# Altium schematic sheet CONNECTOR.SchDoc
size A3; SheetNumber: 5; SheetTotal: 22
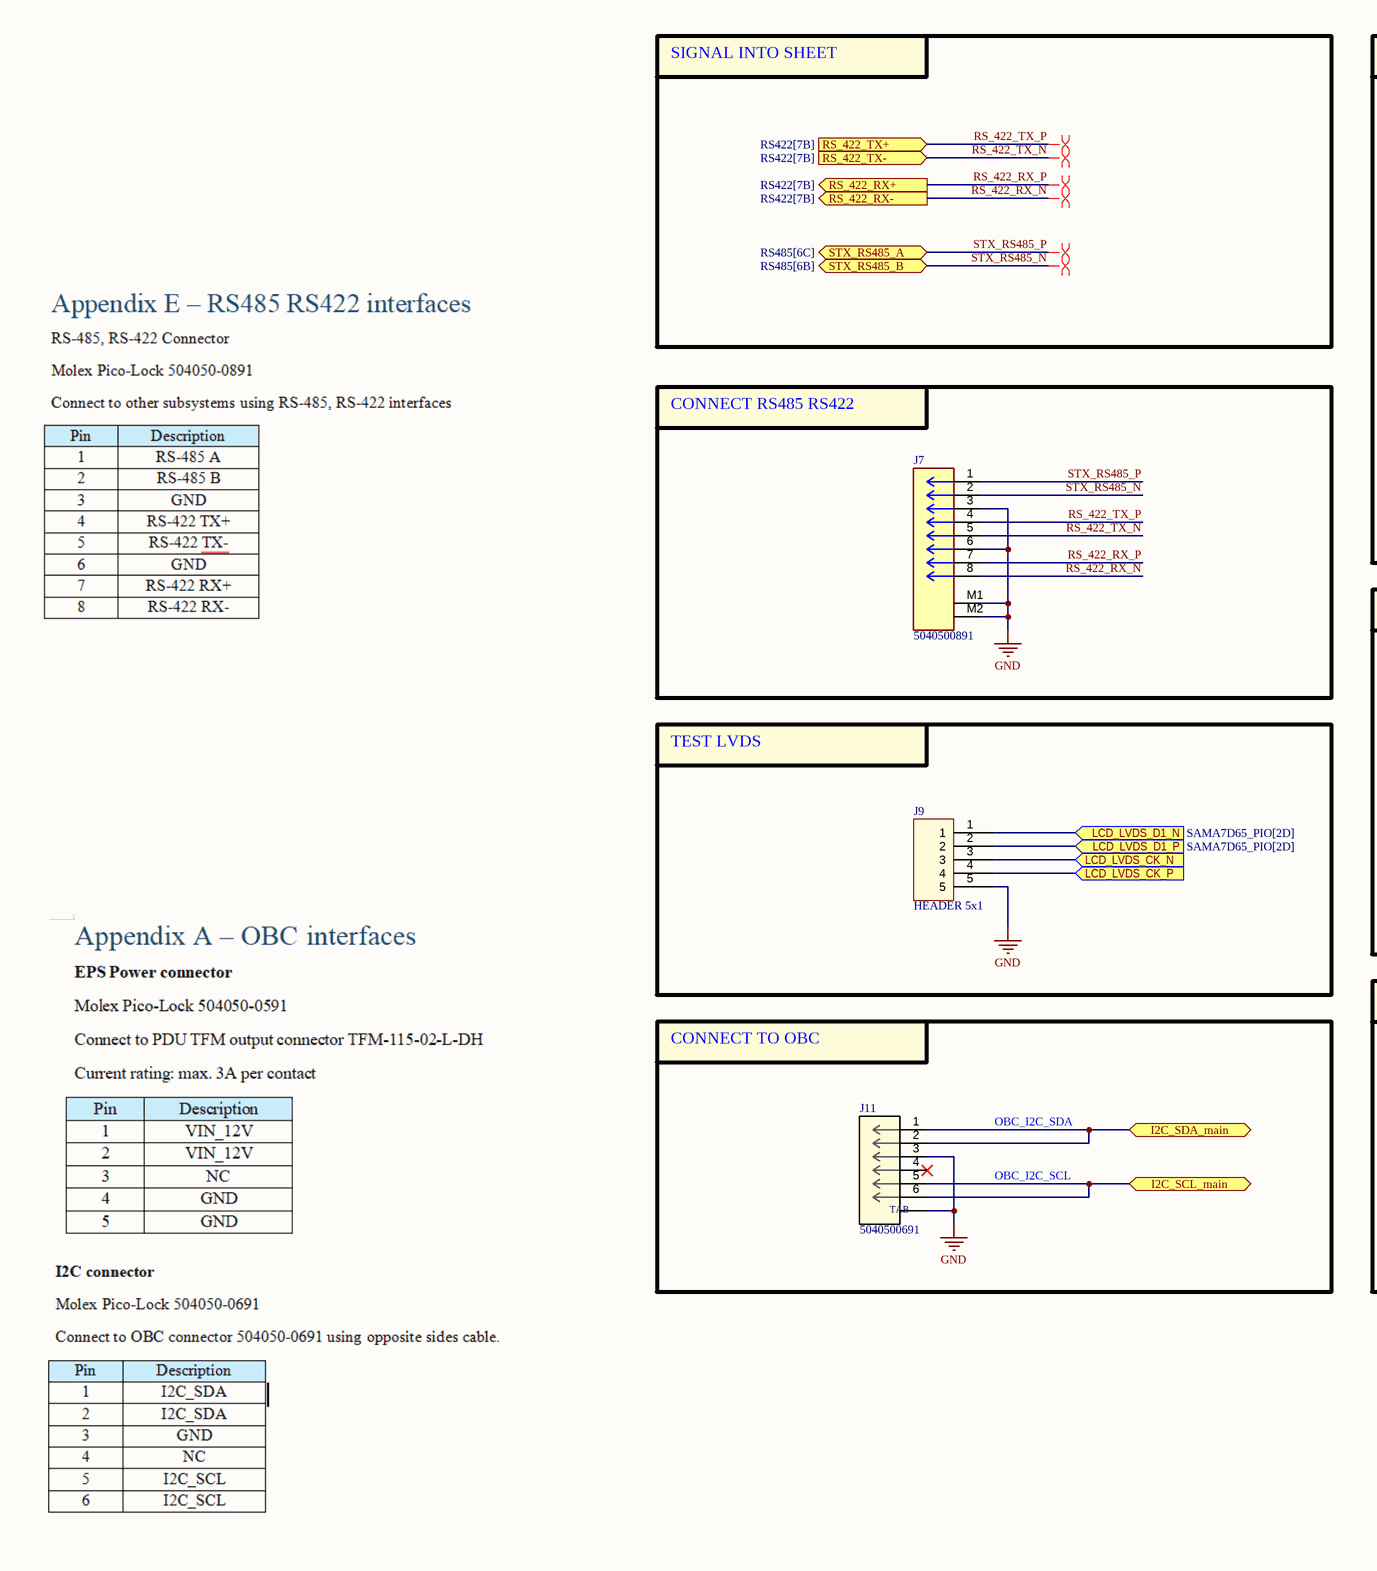
[diagram p0: CONNECTOR.SchDoc, left]
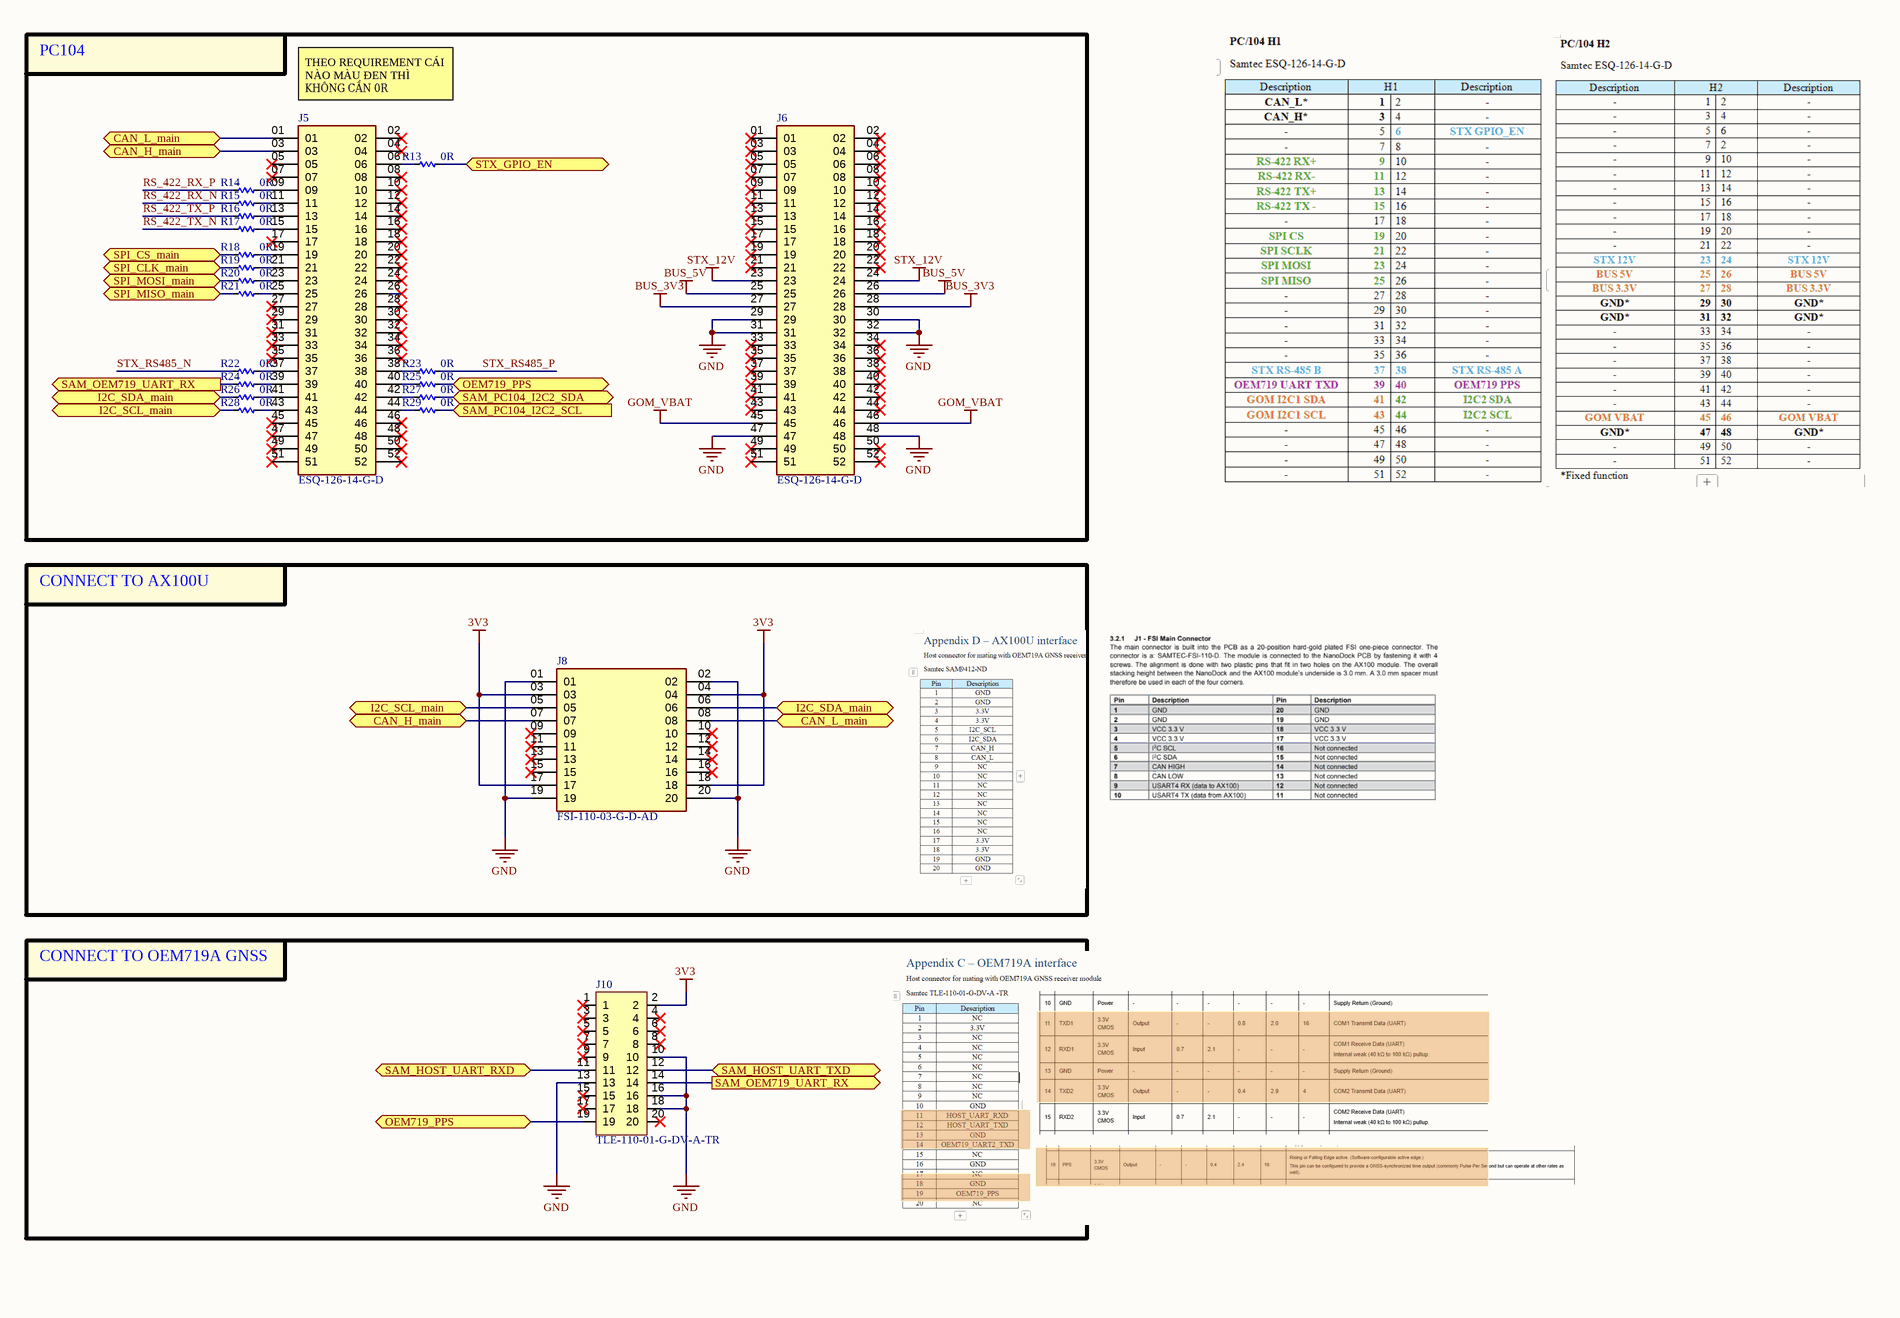
[diagram p1: CONNECTOR.SchDoc, right]

## Parts
J5  ESQ-126-14-G-D  [ESQ-126-14-G-D]
J6  ESQ-126-14-G-D  [ESQ-126-14-G-D]
J7  5040500891  [MOLEX_5040500891]
J8  FSI-110-03-G-D-AD  [SAMTEC_FSI-110-03-X-D-AD-TR]
J9  HEADER 5x1  [Header_254P_5x1]
J10  TLE-110-01-G-DV-A-TR  [SAMTEC-TLE-110-01-X-DV-A]
J11  5040500691  [5040500691]
R13  0R  [RES_C_1005x30_L]
R14  0R  [RES_C_1005x30_L]
R15  0R  [RES_C_1005x30_L]
R16  0R  [RES_C_1005x30_L]
R17  0R  [RES_C_1005x30_L]
R18  0R  [RES_C_1005x30_L]
R19  0R  [RES_C_1005x30_L]
R20  0R  [RES_C_1005x30_L]
R21  0R  [RES_C_1005x30_L]
R22  0R  [RES_C_1005x30_L]
R23  0R  [RES_C_1005x30_L]
R24  0R  [RES_C_1005x30_L]
R25  0R  [RES_C_1005x30_L]
R26  0R  [RES_C_1005x30_L]
R27  0R  [RES_C_1005x30_L]
R28  0R  [RES_C_1005x30_L]
R29  0R  [RES_C_1005x30_L]

## Blocks framed on the sheet
PC104: J5 J6 R13-R29
CONNECT RS485 RS422: J7
CONNECT TO AX100U: J8
TEST LVDS: J9
CONNECT TO OEM719A GNSS: J10
CONNECT TO OBC: J11

## Ports
CAN_H_main (bidir, see CAN_PHY[6A], CAN_PHY[6C], CONNECTOR[4A], CONNECTOR_EXP[5B]), CAN_H_main (bidir, see CAN_PHY[6A], CAN_PHY[6C], CONNECTOR[5C], CONNECTOR_EXP[5B]), CAN_L_main (bidir, see CAN_PHY[6B], CAN_PHY[6C], CONNECTOR[4A], CONNECTOR_EXP[5B]), CAN_L_main (bidir, see CAN_PHY[6B], CAN_PHY[6C], CONNECTOR[7C], CONNECTOR_EXP[5B]), I2C_SCL_main (bidir, see CONNECTOR[3D], CONNECTOR[4B], CONNECTOR_EXP[5C], SAMA7D65_PIO[7B]), I2C_SCL_main (bidir, see CONNECTOR[3D], CONNECTOR[5C], CONNECTOR_EXP[5C], SAMA7D65_PIO[7B]), I2C_SCL_main (bidir, see CONNECTOR[4B], CONNECTOR[5C], CONNECTOR_EXP[5C], SAMA7D65_PIO[7B]), I2C_SDA_main (bidir, see CONNECTOR[3D], CONNECTOR[4B], CONNECTOR_EXP[5C], SAMA7D65_PIO[7B]), I2C_SDA_main (bidir, see CONNECTOR[3D], CONNECTOR[7C], CONNECTOR_EXP[5C], SAMA7D65_PIO[7B]), I2C_SDA_main (bidir, see CONNECTOR[4B], CONNECTOR[7C], CONNECTOR_EXP[5C], SAMA7D65_PIO[7B]), LCD_LVDS_CK_N (in, see SAMA7D65_PIO[2D]), LCD_LVDS_CK_P (in, see SAMA7D65_PIO[2D]), LCD_LVDS_D1_N (in, see SAMA7D65_PIO[2D]), LCD_LVDS_D1_P (in, see SAMA7D65_PIO[2D]), OEM719_PPS (bidir, see CONNECTOR[5D], SAMA7D65_PIO[4B]), OEM719_PPS (bidir, see CONNECTOR[6B], SAMA7D65_PIO[4B]), RS_422_RX+ (out, see RS422[7B]), RS_422_RX- (out, see RS422[7B]), RS_422_TX+ (in, see RS422[7B]), RS_422_TX- (in, see RS422[7B]), SAM_HOST_UART_RXD (bidir, see SAMA7D65_PIO[7C]), SAM_HOST_UART_TXD (bidir, see SAMA7D65_PIO[7C]), SAM_OEM719_UART_RX (out, see CONNECTOR[4B], SAMA7D65_PIO[7C]), SAM_OEM719_UART_RX (out, see CONNECTOR[7D], SAMA7D65_PIO[7C]), SAM_PC104_I2C2_SCL (in, see SAMA7D65_PIO[7A]), SAM_PC104_I2C2_SDA (bidir, see SAMA7D65_PIO[7A]), SPI_CLK_main (bidir, see CONNECTOR_EXP[5C], SAMA7D65_PIO[7B]), SPI_CS_main (bidir, see CONNECTOR_EXP[5C], SAMA7D65_PIO[7B]), SPI_MISO_main (bidir, see CONNECTOR_EXP[5C], SAMA7D65_PIO[7B]), SPI_MOSI_main (bidir, see CONNECTOR_EXP[5C], SAMA7D65_PIO[7B]), STX_GPIO_EN (bidir, see SAMA7D65_PIO[5D]), STX_RS485_A (bidir, see RS485[6C]), STX_RS485_B (bidir, see RS485[6B])

## Nets
3V3: J8.03 J8.04 J8.17 J8.18 J10.2
BUS_3V3: J6.27 J6.28
BUS_5V: J6.25 J6.26
GND: J6.29 J6.30 J6.31 J6.32 J6.47 J6.48 J7.3 J7.6 J7.M1 J7.M2 J8.01 J8.02 J8.19 J8.20 J9.5 J10.10 J10.13 J10.16 J10.18 J11.3 J11.7
GOM_VBAT: J6.45 J6.46
STX_12V: J6.23 J6.24
CAN_H_main: J5.03 J8.07 ; port CAN_H_main
CAN_L_main: J5.01 J8.08 ; port CAN_L_main
I2C_SCL_main: J8.05 J11.5 J11.6 R28.1 ; port I2C_SCL_main
I2C_SDA_main: J8.06 J11.1 J11.2 R26.1 ; port I2C_SDA_main
LCD_LVDS_CK_N: J9.3 ; port LCD_LVDS_CK_N
LCD_LVDS_CK_P: J9.4 ; port LCD_LVDS_CK_P
LCD_LVDS_D1_N: J9.1 ; port LCD_LVDS_D1_N
LCD_LVDS_D1_P: J9.2 ; port LCD_LVDS_D1_P
OEM719_PPS: J10.19 R25.2 ; port OEM719_PPS
RS_422_RX_N: J7.8 R15.1 ; port RS_422_RX-
RS_422_RX_P: J7.7 R14.1 ; port RS_422_RX+
RS_422_TX_N: J7.5 R17.1 ; port RS_422_TX-
RS_422_TX_P: J7.4 R16.1 ; port RS_422_TX+
SAM_HOST_UART_RXD: J10.11 ; port SAM_HOST_UART_RXD
SAM_HOST_UART_TXD: J10.12 ; port SAM_HOST_UART_TXD
SAM_OEM719_UART_RX: J10.14 R24.1 ; port SAM_OEM719_UART_RX
SAM_PC104_I2C2_SCL: R29.2 ; port SAM_PC104_I2C2_SCL
SAM_PC104_I2C2_SDA: R27.2 ; port SAM_PC104_I2C2_SDA
SPI_CLK_main: R19.1 ; port SPI_CLK_main
SPI_CS_main: R18.1 ; port SPI_CS_main
SPI_MISO_main: R21.1 ; port SPI_MISO_main
SPI_MOSI_main: R20.1 ; port SPI_MOSI_main
STX_GPIO_EN: R13.2 ; port STX_GPIO_EN
STX_RS485_N: J7.2 R22.1 ; port STX_RS485_B
STX_RS485_P: J7.1 R23.2 ; port STX_RS485_A
NetJ5_06: J5.06 R13.1
NetJ5_09: J5.09 R14.2
NetJ5_11: J5.11 R15.2
NetJ5_13: J5.13 R16.2
NetJ5_15: J5.15 R17.2
NetJ5_19: J5.19 R18.2
NetJ5_21: J5.21 R19.2
NetJ5_23: J5.23 R20.2
NetJ5_25: J5.25 R21.2
NetJ5_37: J5.37 R22.2
NetJ5_38: J5.38 R23.1
NetJ5_39: J5.39 R24.2
NetJ5_40: J5.40 R25.1
NetJ5_41: J5.41 R26.2
NetJ5_42: J5.42 R27.1
NetJ5_43: J5.43 R28.2
NetJ5_44: J5.44 R29.1

Not connected (* = marked no-connect by the designer): J5 02* 04* 05* 07* 08* 10* 12* 14* 16* 17* 18* 20* 22* 24* 26* 27* 28* 29* 30* 31* 32* 33* 34* 35* 36* 45* 46* 47* 48* 49* 50* 51* 52*; J6 01* 02* 03* 04* 05* 06* 07* 08* 09* 10* 11* 12* 13* 14* 15* 16* 17* 18* 19* 20* 21* 22* 33* 34* 35* 36* 37* 38* 39* 40* 41* 42* 43* 44* 49* 50* 51* 52*; J8 09* 10* 11* 12* 13* 14* 15* 16*; J10 1* 3* 4* 5* 6* 7* 8* 9* 15* 17* 20*; J11 4*

## Layout directives
differential pair: RS_422_RX_N, RS_422_RX_P, RS_422_TX_N, RS_422_TX_P, STX_RS485_N, STX_RS485_P

## Notes on the sheet
- SIGNAL INTO SHEET
- (near J5) THEO REQUIREMENT CÁI NÀO MÀU ĐEN THÌ KHÔNG CẦN 0R
- OBC_I2C_SDA
- OBC_I2C_SCL
- Project:
- Page Contents:
- Revision:
- Design:
- Date:
- Size:
- A3
- Document Number:
- Sheet:
- of
- (in symbol 5040500691) TAB

## Library data of the parts
J5 J6 = ESQ-126-14-G-D: CONN SOCKET 52POS 0.1 GOLD PCB; MF: Samtec; MP: ESQ-126-14-G-D; Price: None; Package: None; Value: *; Availability: Unavailable
J7 = 5040500891: Connector Header Surface Mount, Right Angle 8 position 0.059" (1.50mm)`
J8 = FSI-110-03-X-D-AD-TR: CONN STACKING 20POS SMD GOLD; Price: None; Value: *; Package: None; MP: FSI-110-03-X-D-AD-TR; Availability: Unavailable
J10 = SAMTEC-TLE-110-01-X-DV-A: CONN RCPT 20POS 0.079 GOLD SMD; Availability: Unavailable; MP: SAMTEC-TLE-110-01-X-DV-A; Price: None; Value: *; Package: None
J11 = 5040500691: 1.50mm Pitch, Pico-Lock PCB Header, Single Row, Right-Angle, Surface Mount, Gold (Au) Plating, Positive Lock, 6 Circuits, Tape and Reel; Manufacturer_Name: Molex Connector Corporation; Copyright: Copyright (C) 2025 Ultra Librarian. All rights reserved.; Manufacturer_Part_Number: 5040500691; Datasheet: https://www.molex.com/en-us/products/part-detail-pdf/5040500691?display=pdf; RefDes: RefDes; Type: Type
R13-R29 = _RES_B_2: RES